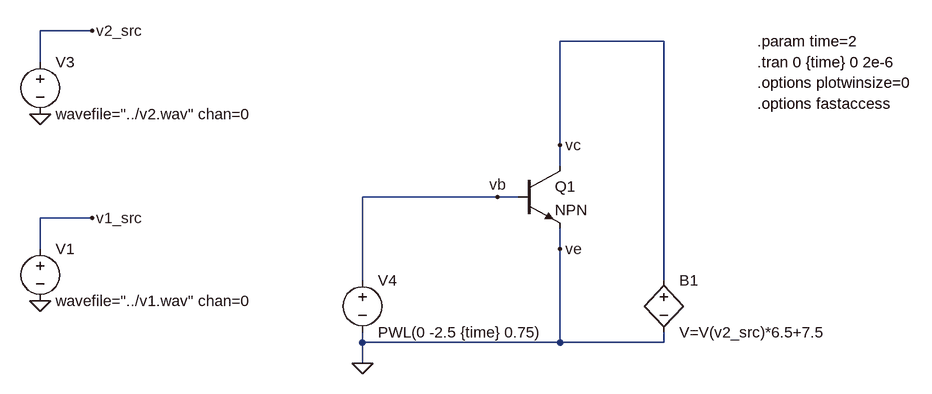
[diagram p0: schematic two_port_collect_circuit.asc]
two_port_collect_circuit.asc, the LTspice schematic file:
Version 4
SHEET 1 908 680
WIRE -384 -96 -464 -96
WIRE 496 -80 336 -80
WIRE -464 -48 -464 -96
WIRE 336 80 336 -80
WIRE 336 112 336 80
WIRE 240 160 32 160
WIRE 272 160 240 160
WIRE -384 192 -464 192
WIRE -464 240 -464 192
WIRE 336 240 336 208
WIRE 32 288 32 160
WIRE 496 288 496 -80
WIRE 32 384 32 368
WIRE 336 384 336 240
WIRE 336 384 32 384
WIRE 496 384 496 368
WIRE 496 384 336 384
WIRE 32 416 32 384
FLAG 32 416 0
FLAG -464 320 0
FLAG -464 32 0
FLAG -384 192 v1_src
FLAG -384 -96 v2_src
FLAG 240 160 vb
FLAG 336 80 vc
FLAG 336 240 ve
SYMBOL npn 272 112 R0
SYMATTR InstName Q1
SYMBOL voltage -464 224 R0
SYMATTR InstName V1
SYMATTR Value wavefile="../v1.wav" chan=0
SYMBOL voltage -464 -64 R0
SYMATTR InstName V3
SYMATTR Value wavefile="../v2.wav" chan=0
SYMBOL voltage 32 272 R0
WINDOW 123 0 0 Left 0
WINDOW 39 0 0 Left 0
SYMATTR InstName V4
SYMATTR Value PWL(0 -2.5 {time} 0.75)
SYMBOL bv 496 272 R0
SYMATTR InstName B1
SYMATTR Value V=V(v2_src)*6.5+7.5
TEXT 640 -80 Left 2 !.param time=2
TEXT 640 -48 Left 2 !.tran 0 {time} 0 2e-6
TEXT 640 -16 Left 2 !.options plotwinsize=0
TEXT 640 16 Left 2 !.options fastaccess

The netlist it stands for:
* two_port_collect_circuit.asc
Q1 vc vb 0 0 NPN
V1 v1_src 0 wavefile="../v1.wav" chan=0
V3 v2_src 0 wavefile="../v2.wav" chan=0
V4 vb 0 PWL(0 -2.5 {time} 0.75)
B1 vc 0 V=V(v2_src)*6.5+7.5
.model NPN NPN
.model PNP PNP
.lib standard.bjt
.param time=2
.tran 0 {time} 0 2e-6
.options plotwinsize=0
.options fastaccess
.backanno
.end